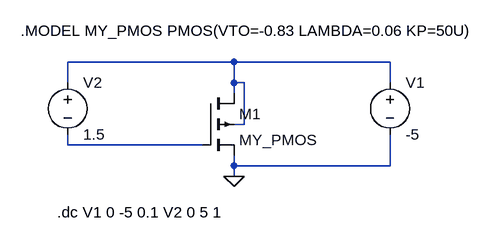
[diagram p0: schematic Draft3.asc]
Draft3.asc, the LTspice schematic file:
Version 4
SHEET 1 880 680
WIRE 176 64 -80 64
WIRE 416 64 176 64
WIRE -80 96 -80 64
WIRE 176 96 176 64
WIRE 192 96 176 96
WIRE 416 96 416 64
WIRE 176 112 176 96
WIRE 192 160 192 96
WIRE 192 160 176 160
WIRE -80 192 -80 176
WIRE 128 192 -80 192
WIRE 176 224 176 208
WIRE 416 224 416 176
WIRE 416 224 176 224
WIRE 176 240 176 224
FLAG 176 240 0
SYMBOL pmos4 128 112 R0
SYMATTR InstName M1
SYMATTR Value MY_PMOS
SYMATTR Value2 l=5um w=10um
SYMBOL voltage 416 80 R0
SYMATTR InstName V1
SYMATTR Value -5
SYMBOL voltage -80 80 R0
SYMATTR InstName V2
SYMATTR Value 1.5
TEXT -152 16 Left 2 !.MODEL MY_PMOS PMOS(VTO=-0.83 LAMBDA=0.06 KP=50U)
TEXT -96 296 Left 2 !.dc V1 0 -5 0.1 V2 0 5 1

The netlist it stands for:
* Draft3.asc
M1 N001 N002 0 N001 MY_PMOS l=5um w=10um
V1 N001 0 -5
V2 N001 N002 1.5
.model NMOS NMOS
.model PMOS PMOS
.lib standard.mos
.MODEL MY_PMOS PMOS(VTO=-0.83 LAMBDA=0.06 KP=50U)
.dc V1 0 -5 0.1 V2 0 5 1
.backanno
.end